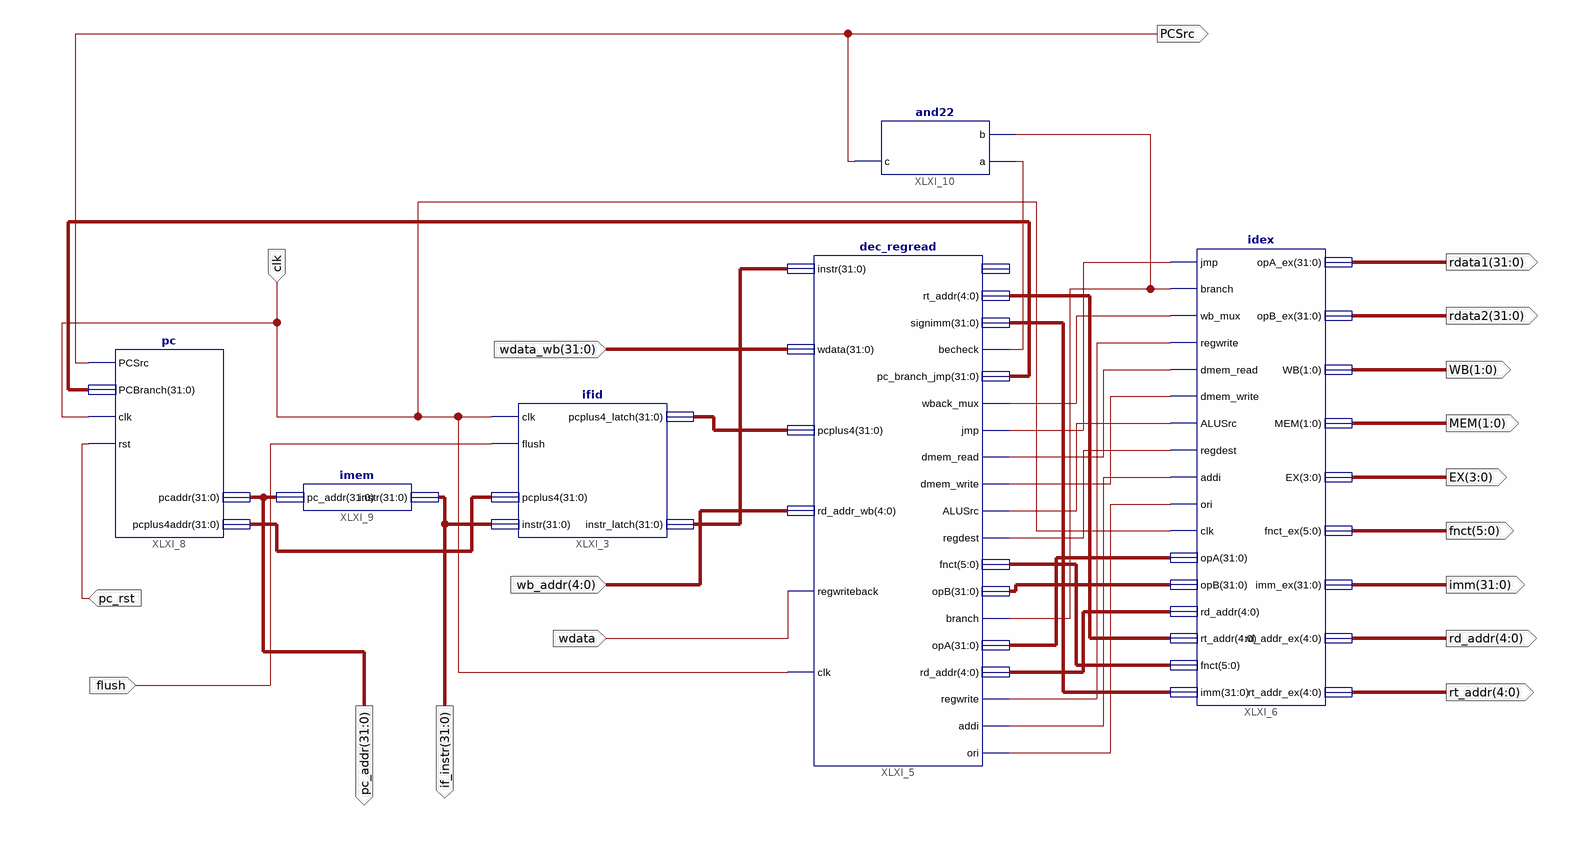
[diagram p0: schematic sheet 1]
// Xilinx ISE schematic pc_if_ifid_dec_idex.sch (spartan3a) as structural Verilog: 6 symbols, 18 ports
module pc_if_ifid_dec_idex (
  input  clk,
  input  [31:0] wdata_wb,
  input  [4:0] wb_addr,
  input  wdata,
  input  flush,
  input  pc_rst,
  output [31:0] pc_addr,
  output [31:0] if_instr,
  output PCSrc,
  output [31:0] rdata1,
  output [31:0] rdata2,
  output [1:0] WB,
  output [1:0] MEM,
  output [3:0] EX,
  output [5:0] fnct,
  output [31:0] imm,
  output [4:0] rd_addr,
  output [4:0] rt_addr
);

  wire XLXN_12, XLXN_13, XLXN_14, XLXN_15, XLXN_16, XLXN_17, XLXN_19, XLXN_20, XLXN_21, XLXN_22, XLXN_25;
  wire [4:0] XLXN_9, XLXN_10;
  wire [5:0] XLXN_11;
  wire [31:0] XLXN_3, XLXN_6, XLXN_7, XLXN_18, XLXN_23, XLXN_24, XLXN_28;

  ifid XLXI_3 (
    .clk(clk), .flush(flush), .pcplus4(XLXN_3), .instr(if_instr), .pcplus4_latch(XLXN_7), .instr_latch(XLXN_6));
  dec_regread XLXI_5 (
    .instr(XLXN_6), .wdata(wdata_wb), .pcplus4(XLXN_7), .rd_addr_wb(wb_addr), .regwriteback(wdata),
    .clk(clk), .rt_addr(XLXN_9), .signimm(XLXN_18), .becheck(XLXN_25), .pc_branch_jmp(XLXN_28),
    .wback_mux(XLXN_14), .jmp(XLXN_13), .dmem_read(XLXN_19), .dmem_write(XLXN_20), .ALUSrc(XLXN_21),
    .regdest(XLXN_22), .fnct(XLXN_11), .opB(XLXN_23), .branch(XLXN_12), .opA(XLXN_24), .rd_addr(XLXN_10),
    .regwrite(XLXN_15), .addi(XLXN_16), .ori(XLXN_17));  // open: rs_addr
  idex XLXI_6 (
    .jmp(XLXN_13), .branch(XLXN_12), .wb_mux(XLXN_14), .regwrite(XLXN_15), .dmem_read(XLXN_19),
    .dmem_write(XLXN_20), .ALUSrc(XLXN_21), .regdest(XLXN_22), .addi(XLXN_16), .ori(XLXN_17), .clk(clk),
    .opA(XLXN_24), .opB(XLXN_23), .rd_addr(XLXN_10), .rt_addr(XLXN_9), .fnct(XLXN_11), .imm(XLXN_18),
    .opA_ex(rdata1), .opB_ex(rdata2), .WB(WB), .MEM(MEM), .EX(EX), .fnct_ex(fnct), .imm_ex(imm),
    .rd_addr_ex(rd_addr), .rt_addr_ex(rt_addr));
  pc XLXI_8 (.PCSrc(PCSrc), .PCBranch(XLXN_28), .clk(clk), .rst(pc_rst), .pcaddr(pc_addr), .pcplus4addr(XLXN_3));
  imem XLXI_9 (.pc_addr(pc_addr), .instr(if_instr));
  and22 XLXI_10 (.a(XLXN_25), .b(XLXN_12), .c(PCSrc));
endmodule
